# Altium schematic sheet MCU.SchDoc
size A4; Organization: Altium Limited; Address1: L3, 12a Rodborough Rd; Address2: Frenchs Forest; Address3: NSW; Address4: Australia 2086
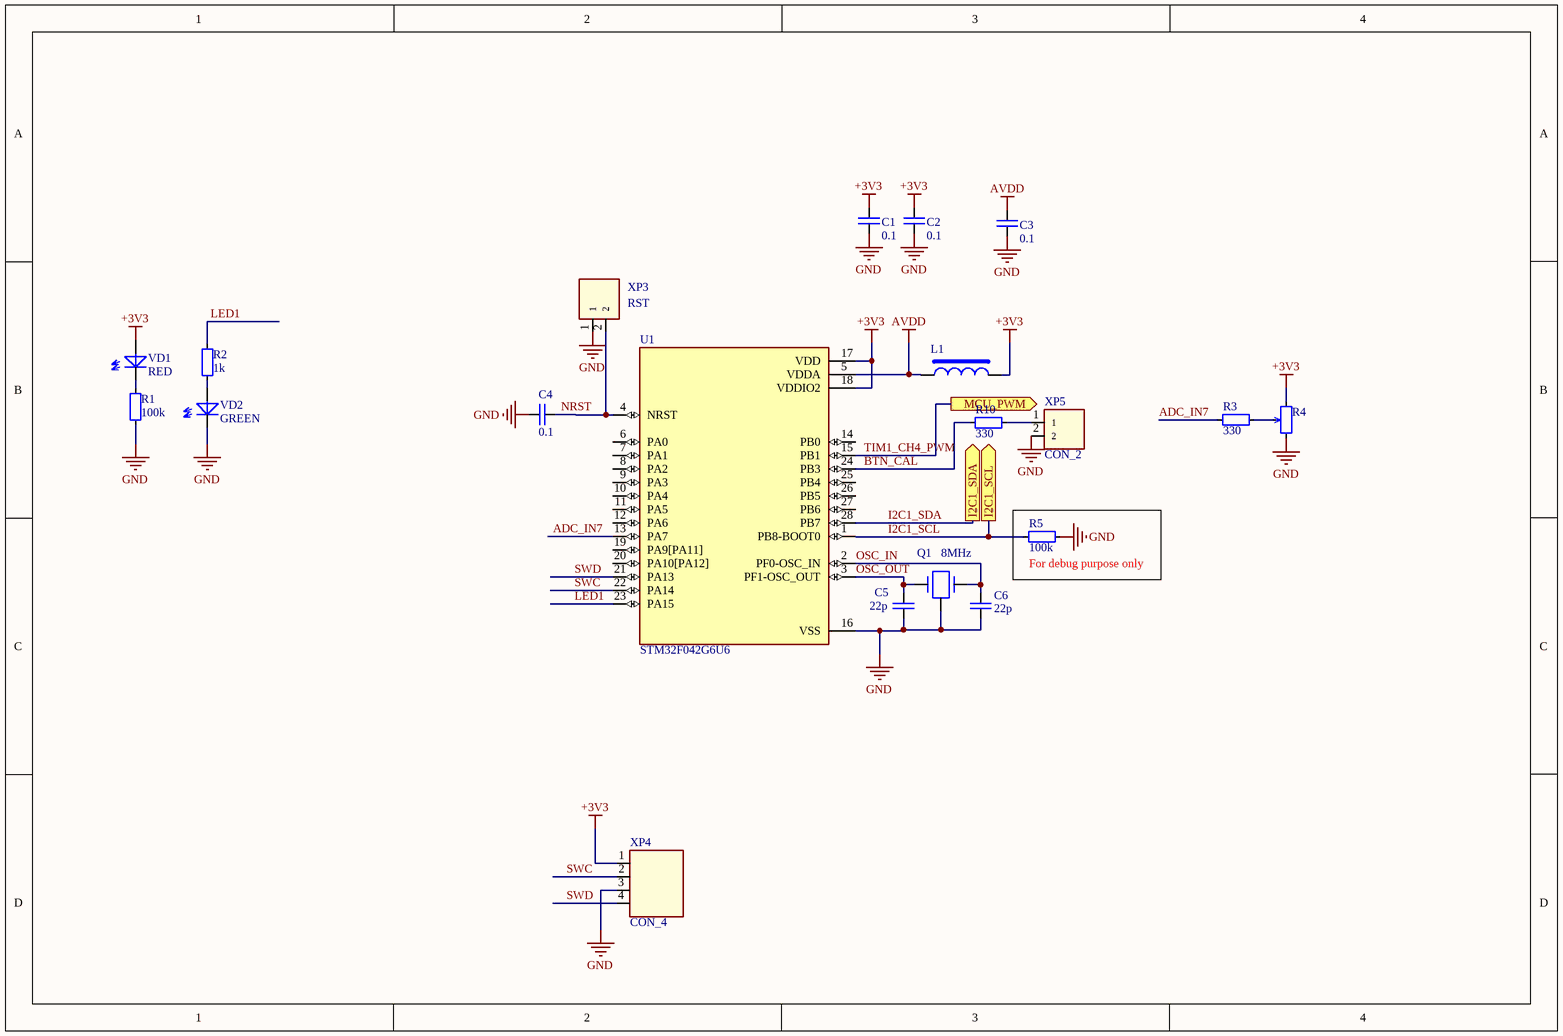
[diagram p0: MCU.SchDoc]

## Parts
C1  0.1  [CAP_0603]
C2  0.1  [CAP_0603]
C3  0.1  [CAP_0603]
C4  0.1  [CAP_0603]
C5  22p  [CAP_0603]
C6  22p  [CAP_0603]
L1  (no value)  [SMD_0603]
Q1  8MHz  [CSTCC-CRYSTAL]
R1  100k  [SMD_0603]
R2  1k  [SMD_0603]
R3  330  [SMD_0603]
R4  (no value)  [RES-ADJ-SMD-Panasonic]
R5  100k  [SMD_0603]
R10  330  [SMD_0603]
U1  STM32F042G6U6  [UFQFPN_4x4_STM32F042G6U6]
VD1  RED  [LED_0603]
VD2  GREEN  [LED_0603]
XP3  RST  [HEAD_MICRO_SF_1.27-2]
XP4  CON_4  [HEAD-1/4/2.54]
XP5  CON_2  [HEAD_MICRO_SF_1.27-2]

## Blocks framed on the sheet
For debug purpose only: R5

## Ports
I2C1_SCL (out), I2C1_SDA (out), MCU_PWM (out)

## Nets
+3V3: C1.1 C2.1 L1.2 R4.2 U1.17(VDD) U1.18(VDDIO2) VD1.2(A) XP4.1
AVDD: C3.1 L1.1 U1.5(VDDA)
GND: C1.2 C2.2 C3.2 C4.1 C5.2 C6.2 Q1.2 R1.2 R4.1 R5.1 U1.16(VSS) VD2.1(C) XP3.1 XP4.3 XP5.2
ADC_IN7: R3.2 U1.13(PA7)
BTN_CAL: R10.2 U1.24(PB3)
I2C1_SCL: R5.2 U1.1(PB8-BOOT0) ; port I2C1_SCL
I2C1_SDA: U1.28(PB7) ; port I2C1_SDA
LED1: R2.1 U1.23(PA15)
NRST: C4.2 U1.4(NRST) XP3.2
OSC_IN: C6.1 Q1.1 U1.2(PF0-OSC_IN)
OSC_OUT: C5.1 Q1.3 U1.3(PF1-OSC_OUT)
SWC: U1.22(PA14) XP4.2
SWD: U1.21(PA13) XP4.4
TIM1_CH4_PWM: U1.15(PB1) ; port MCU_PWM
NetR1_1: R1.1 VD1.1(C)
NetR2_2: R2.2 VD2.2(A)
NetR3_1: R3.1 R4.3
NetR10_1: R10.1 XP5.1

Not connected (* = marked no-connect by the designer): U1 6(PA0) 7(PA1) 8(PA2) 9(PA3) 10(PA4) 11(PA5) 12(PA6) 14(PB0) 19(PA9[PA11]) 20(PA10[PA12]) 25(PB4) 26(PB5) 27(PB6)

## Notes on the sheet
- Title
- Size:
- Date:
- A4
- Number:
- Time:
- Revision:
- Sheet
- of
- File:

## Library data of the parts
C1-C6 = C_NONE_POLAR: None polar capacitor; Case: 0603
  C1-C4: Value: 0.1
  C5 C6: Value: 22p
L1 = FB: Ferrite Bread
Q1 = CRYSTAL_CAP: Crystal oscillator; Model: CSTCC8M00G53A-R0; Value: 8MHz
R1-R3 R5 R10 = RES: Resistor
  R1 R5: Value: 100k; Case: 0603
  R2: Value: 1k; Case: 0603
  R3 R10: Value: 330; Case: *
R4 = RES_ADJ: Agjustable resistor
U1 = STM32F042G6U6: ARM Cortex-M0 STM32F0 Microcontroller IC 32-Bit 48MHz 32KB x 8kB FLASH 28-UFQFPN _4x4_; MF: STMicroelectronics; Package: UFQFN-28 STMicroelectronics; Availability: Unavailable; SnapEDA_Link: https://www.snapeda.com/parts/STM32F042G6U6/STMicroelectronics/view-part/225452/?ref=snap; MP: STM32F042G6U6; Price: None; Value: *
VD1 VD2 = LED
  VD1: Value: RED
  VD2: Value: GREEN
XP3 = CON_2